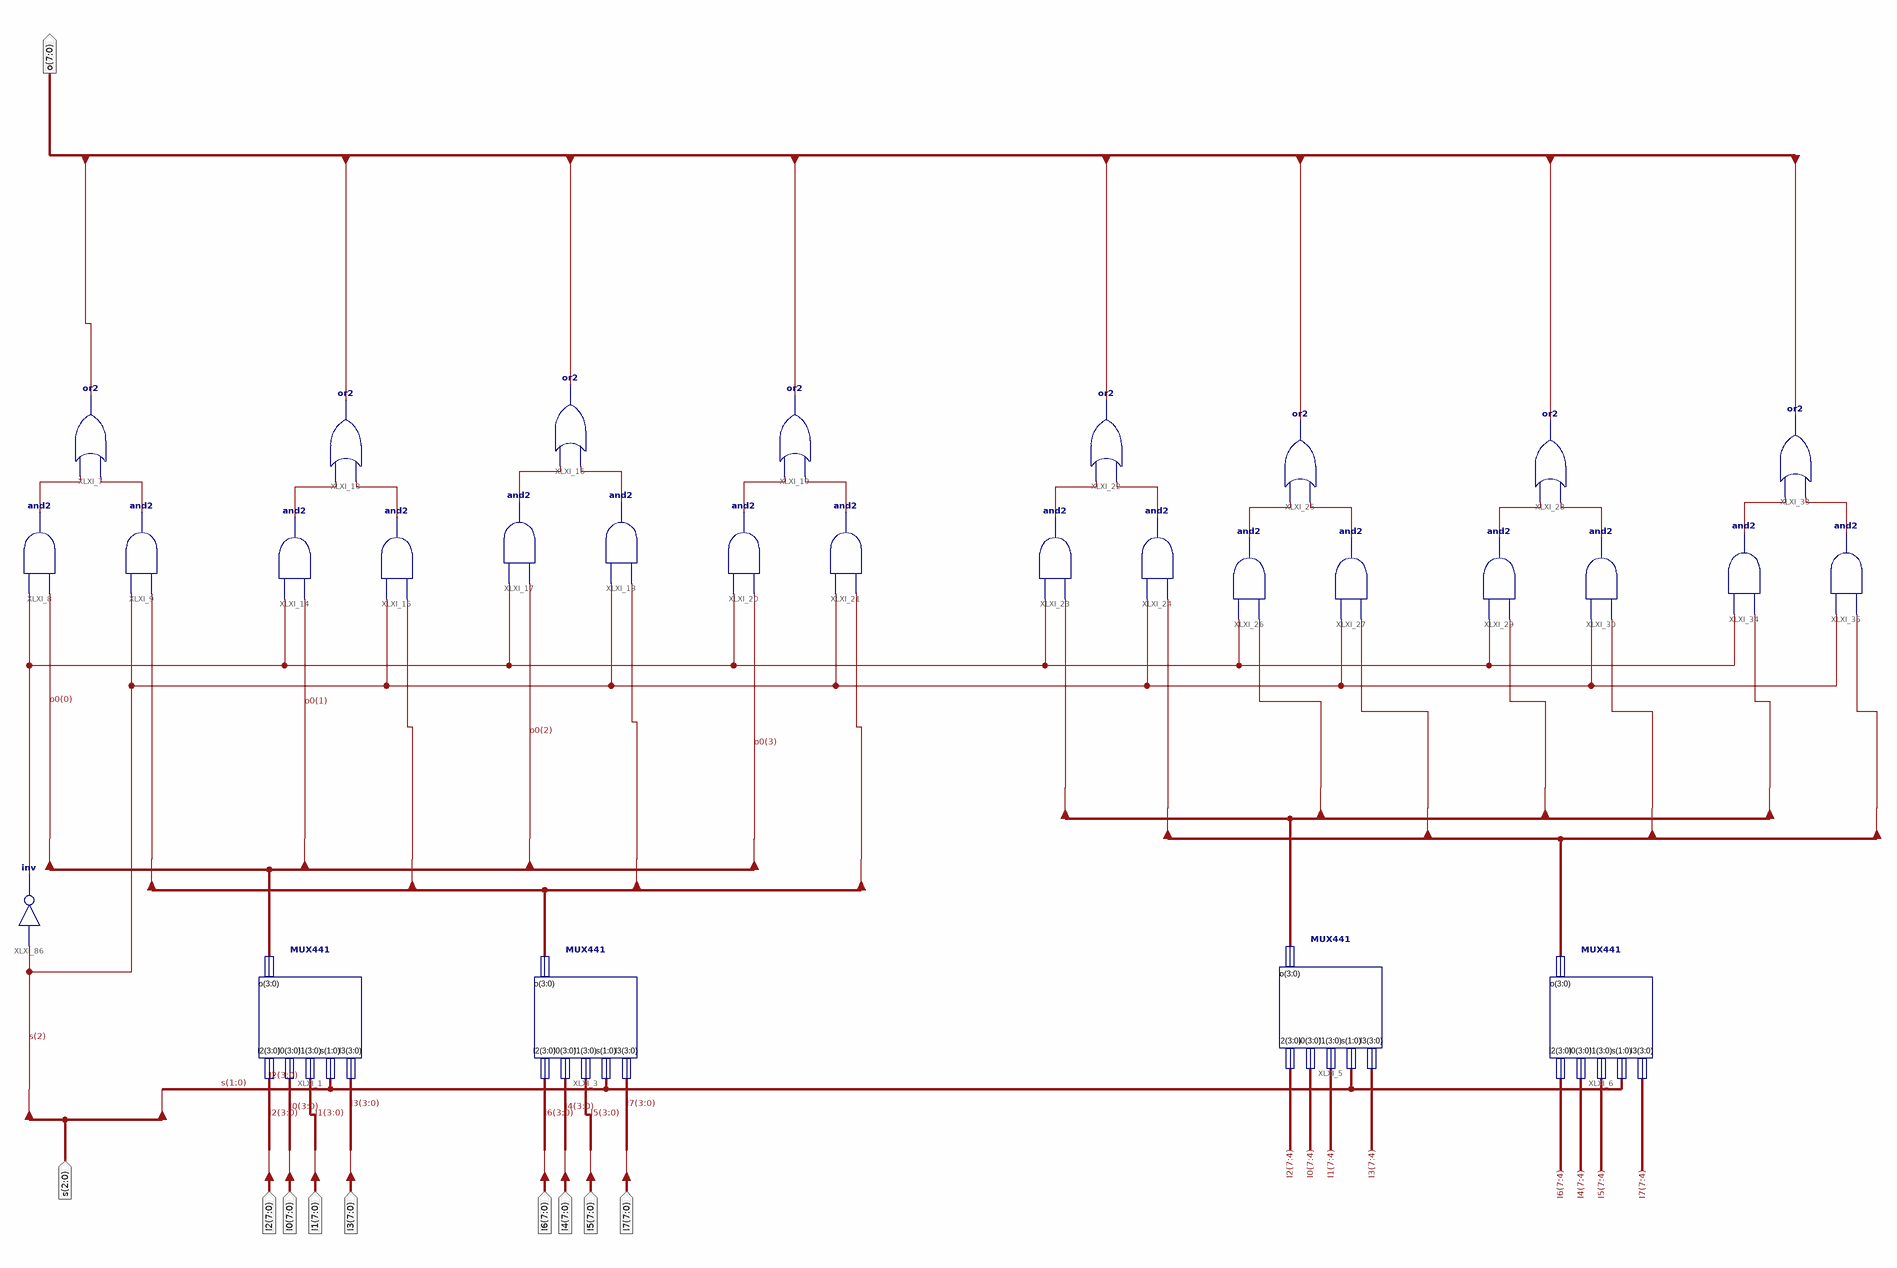
[diagram p0: schematic sheet 1]
// Xilinx ISE schematic MUX8T1_8.sch (kintex7) as structural Verilog: 29 symbols, 10 ports
module MUX8T1_8 (
  input  [7:0] I0,
  input  [7:0] I1,
  input  [7:0] I2,
  input  [7:0] I3,
  input  [7:0] I4,
  input  [7:0] I5,
  input  [7:0] I6,
  input  [7:0] I7,
  input  [2:0] s,
  output [7:0] o
);

  wire XLXN_47, XLXN_48, XLXN_57, XLXN_58, XLXN_60, XLXN_61, XLXN_63, XLXN_64, XLXN_66, XLXN_67, XLXN_69,
       XLXN_70, XLXN_72, XLXN_73, XLXN_77, XLXN_78, XLXN_140;
  wire [3:0] o0, o1, o2, o3;

  MUX441 XLXI_1 (.I2(I2[3:0]), .I0(I0[3:0]), .I1(I1[3:0]), .s(s[1:0]), .I3(I3[3:0]), .o(o0));
  MUX441 XLXI_3 (.I2(I6[3:0]), .I0(I4[3:0]), .I1(I5[3:0]), .s(s[1:0]), .I3(I7[3:0]), .o(o1));
  or XLXI_16 (o[2], XLXN_61, XLXN_60);
  and XLXI_17 (XLXN_60, o0[2], XLXN_140);
  and XLXI_18 (XLXN_61, o1[2], s[2]);
  or XLXI_13 (o[1], XLXN_58, XLXN_57);
  and XLXI_14 (XLXN_57, o0[1], XLXN_140);
  and XLXI_15 (XLXN_58, o1[1], s[2]);
  or XLXI_19 (o[3], XLXN_64, XLXN_63);
  and XLXI_20 (XLXN_63, o0[3], XLXN_140);
  and XLXI_21 (XLXN_64, o1[3], s[2]);
  or XLXI_22 (o[4], XLXN_67, XLXN_66);
  and XLXI_23 (XLXN_66, o2[0], XLXN_140);
  and XLXI_24 (XLXN_67, o3[0], s[2]);
  or XLXI_25 (o[5], XLXN_70, XLXN_69);
  and XLXI_26 (XLXN_69, o2[1], XLXN_140);
  and XLXI_27 (XLXN_70, o3[1], s[2]);
  or XLXI_28 (o[6], XLXN_73, XLXN_72);
  and XLXI_29 (XLXN_72, o2[2], XLXN_140);
  and XLXI_30 (XLXN_73, o3[2], s[2]);
  or XLXI_33 (o[7], XLXN_78, XLXN_77);
  and XLXI_34 (XLXN_77, o2[3], XLXN_140);
  and XLXI_35 (XLXN_78, o3[3], s[2]);
  not XLXI_86 (XLXN_140, s[2]);
  or XLXI_7 (o[0], XLXN_48, XLXN_47);
  and XLXI_8 (XLXN_47, o0[0], XLXN_140);
  and XLXI_9 (XLXN_48, o1[0], s[2]);
  MUX441 XLXI_6 (.I2(I6[7:4]), .I0(I4[7:4]), .I1(I5[7:4]), .s(s[1:0]), .I3(I7[7:4]), .o(o3));
  MUX441 XLXI_5 (.I2(I2[7:4]), .I0(I0[7:4]), .I1(I1[7:4]), .s(s[1:0]), .I3(I3[7:4]), .o(o2));
endmodule
